# Altium schematic sheet B2-3-2.SchDoc
size A4
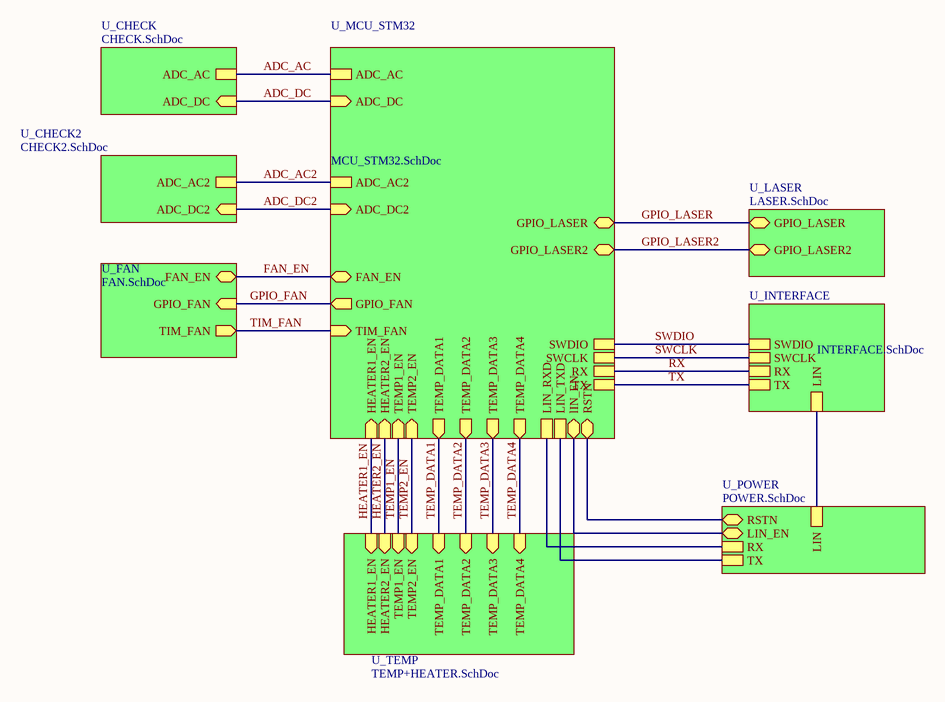
[diagram p0: B2-3-2.SchDoc]

## Sub-sheets
U_CHECK = CHECK.SchDoc: ADC_AC, ADC_DC (in)
U_CHECK2 = CHECK2.SchDoc: ADC_AC2, ADC_DC2 (in)
U_FAN = FAN.SchDoc: GPIO_FAN (in), TIM_FAN (out), FAN_EN
U_INTERFACE = INTERFACE.SchDoc: SWDIO, SWCLK, RX, TX, LIN
U_LASER = LASER.SchDoc: GPIO_LASER, GPIO_LASER2
U_MCU_STM32 = MCU_STM32.SchDoc: ADC_AC, SWDIO, SWCLK, RX, TX, TIM_FAN (in), GPIO_FAN (out), GPIO_LASER, GPIO_LASER2, FAN_EN, ADC_AC2, TEMP_DATA2 (out), TEMP_DATA1 (out), TEMP_DATA3 (out), TEMP_DATA4 (out), LIN_TXD, LIN_RXD, lIN_EN, RSTN, ADC_DC (in), ADC_DC2 (in), TEMP2_EN (in), TEMP1_EN (in), HEATER2_EN (in), HEATER1_EN (in)
U_POWER = POWER.SchDoc: RX, TX, LIN, LIN_EN, RSTN
U_TEMP = TEMP+HEATER.SchDoc: TEMP_DATA2 (in), TEMP_DATA1 (in), TEMP_DATA3 (in), TEMP_DATA4 (in), TEMP1_EN (in), TEMP2_EN (in), HEATER2_EN (in), HEATER1_EN (in)

## Nets
ADC_AC: sheet U_CHECK/ADC_AC, sheet U_MCU_STM32/ADC_AC
ADC_AC2: sheet U_MCU_STM32/ADC_AC2, sheet U_CHECK2/ADC_AC2
ADC_DC: sheet U_CHECK/ADC_DC, sheet U_MCU_STM32/ADC_DC
ADC_DC2: sheet U_MCU_STM32/ADC_DC2, sheet U_CHECK2/ADC_DC2
FAN_EN: sheet U_FAN/FAN_EN, sheet U_MCU_STM32/FAN_EN
GPIO_FAN: sheet U_FAN/GPIO_FAN, sheet U_MCU_STM32/GPIO_FAN
GPIO_LASER: sheet U_LASER/GPIO_LASER, sheet U_MCU_STM32/GPIO_LASER
GPIO_LASER2: sheet U_LASER/GPIO_LASER2, sheet U_MCU_STM32/GPIO_LASER2
HEATER1_EN: sheet U_MCU_STM32/HEATER1_EN, sheet U_TEMP/HEATER1_EN
HEATER2_EN: sheet U_MCU_STM32/HEATER2_EN, sheet U_TEMP/HEATER2_EN
RX: sheet U_INTERFACE/RX, sheet U_MCU_STM32/RX
SWCLK: sheet U_INTERFACE/SWCLK, sheet U_MCU_STM32/SWCLK
SWDIO: sheet U_INTERFACE/SWDIO, sheet U_MCU_STM32/SWDIO
TEMP1_EN: sheet U_MCU_STM32/TEMP1_EN, sheet U_TEMP/TEMP1_EN
TEMP2_EN: sheet U_MCU_STM32/TEMP2_EN, sheet U_TEMP/TEMP2_EN
TEMP_DATA1: sheet U_MCU_STM32/TEMP_DATA1, sheet U_TEMP/TEMP_DATA1
TEMP_DATA2: sheet U_MCU_STM32/TEMP_DATA2, sheet U_TEMP/TEMP_DATA2
TEMP_DATA3: sheet U_MCU_STM32/TEMP_DATA3, sheet U_TEMP/TEMP_DATA3
TEMP_DATA4: sheet U_MCU_STM32/TEMP_DATA4, sheet U_TEMP/TEMP_DATA4
TIM_FAN: sheet U_FAN/TIM_FAN, sheet U_MCU_STM32/TIM_FAN
TX: sheet U_INTERFACE/TX, sheet U_MCU_STM32/TX
(unnamed): sheet U_INTERFACE/LIN, sheet U_POWER/LIN
(unnamed): sheet U_MCU_STM32/LIN_TXD, sheet U_POWER/TX
(unnamed): sheet U_MCU_STM32/LIN_RXD, sheet U_POWER/RX
(unnamed): sheet U_MCU_STM32/lIN_EN, sheet U_POWER/LIN_EN
(unnamed): sheet U_MCU_STM32/RSTN, sheet U_POWER/RSTN